# Altium schematic sheet Gagabiro_power_supply_maida.SchDoc
size 393 x 281 mm; SheetNumber: 3; SheetTotal: 4
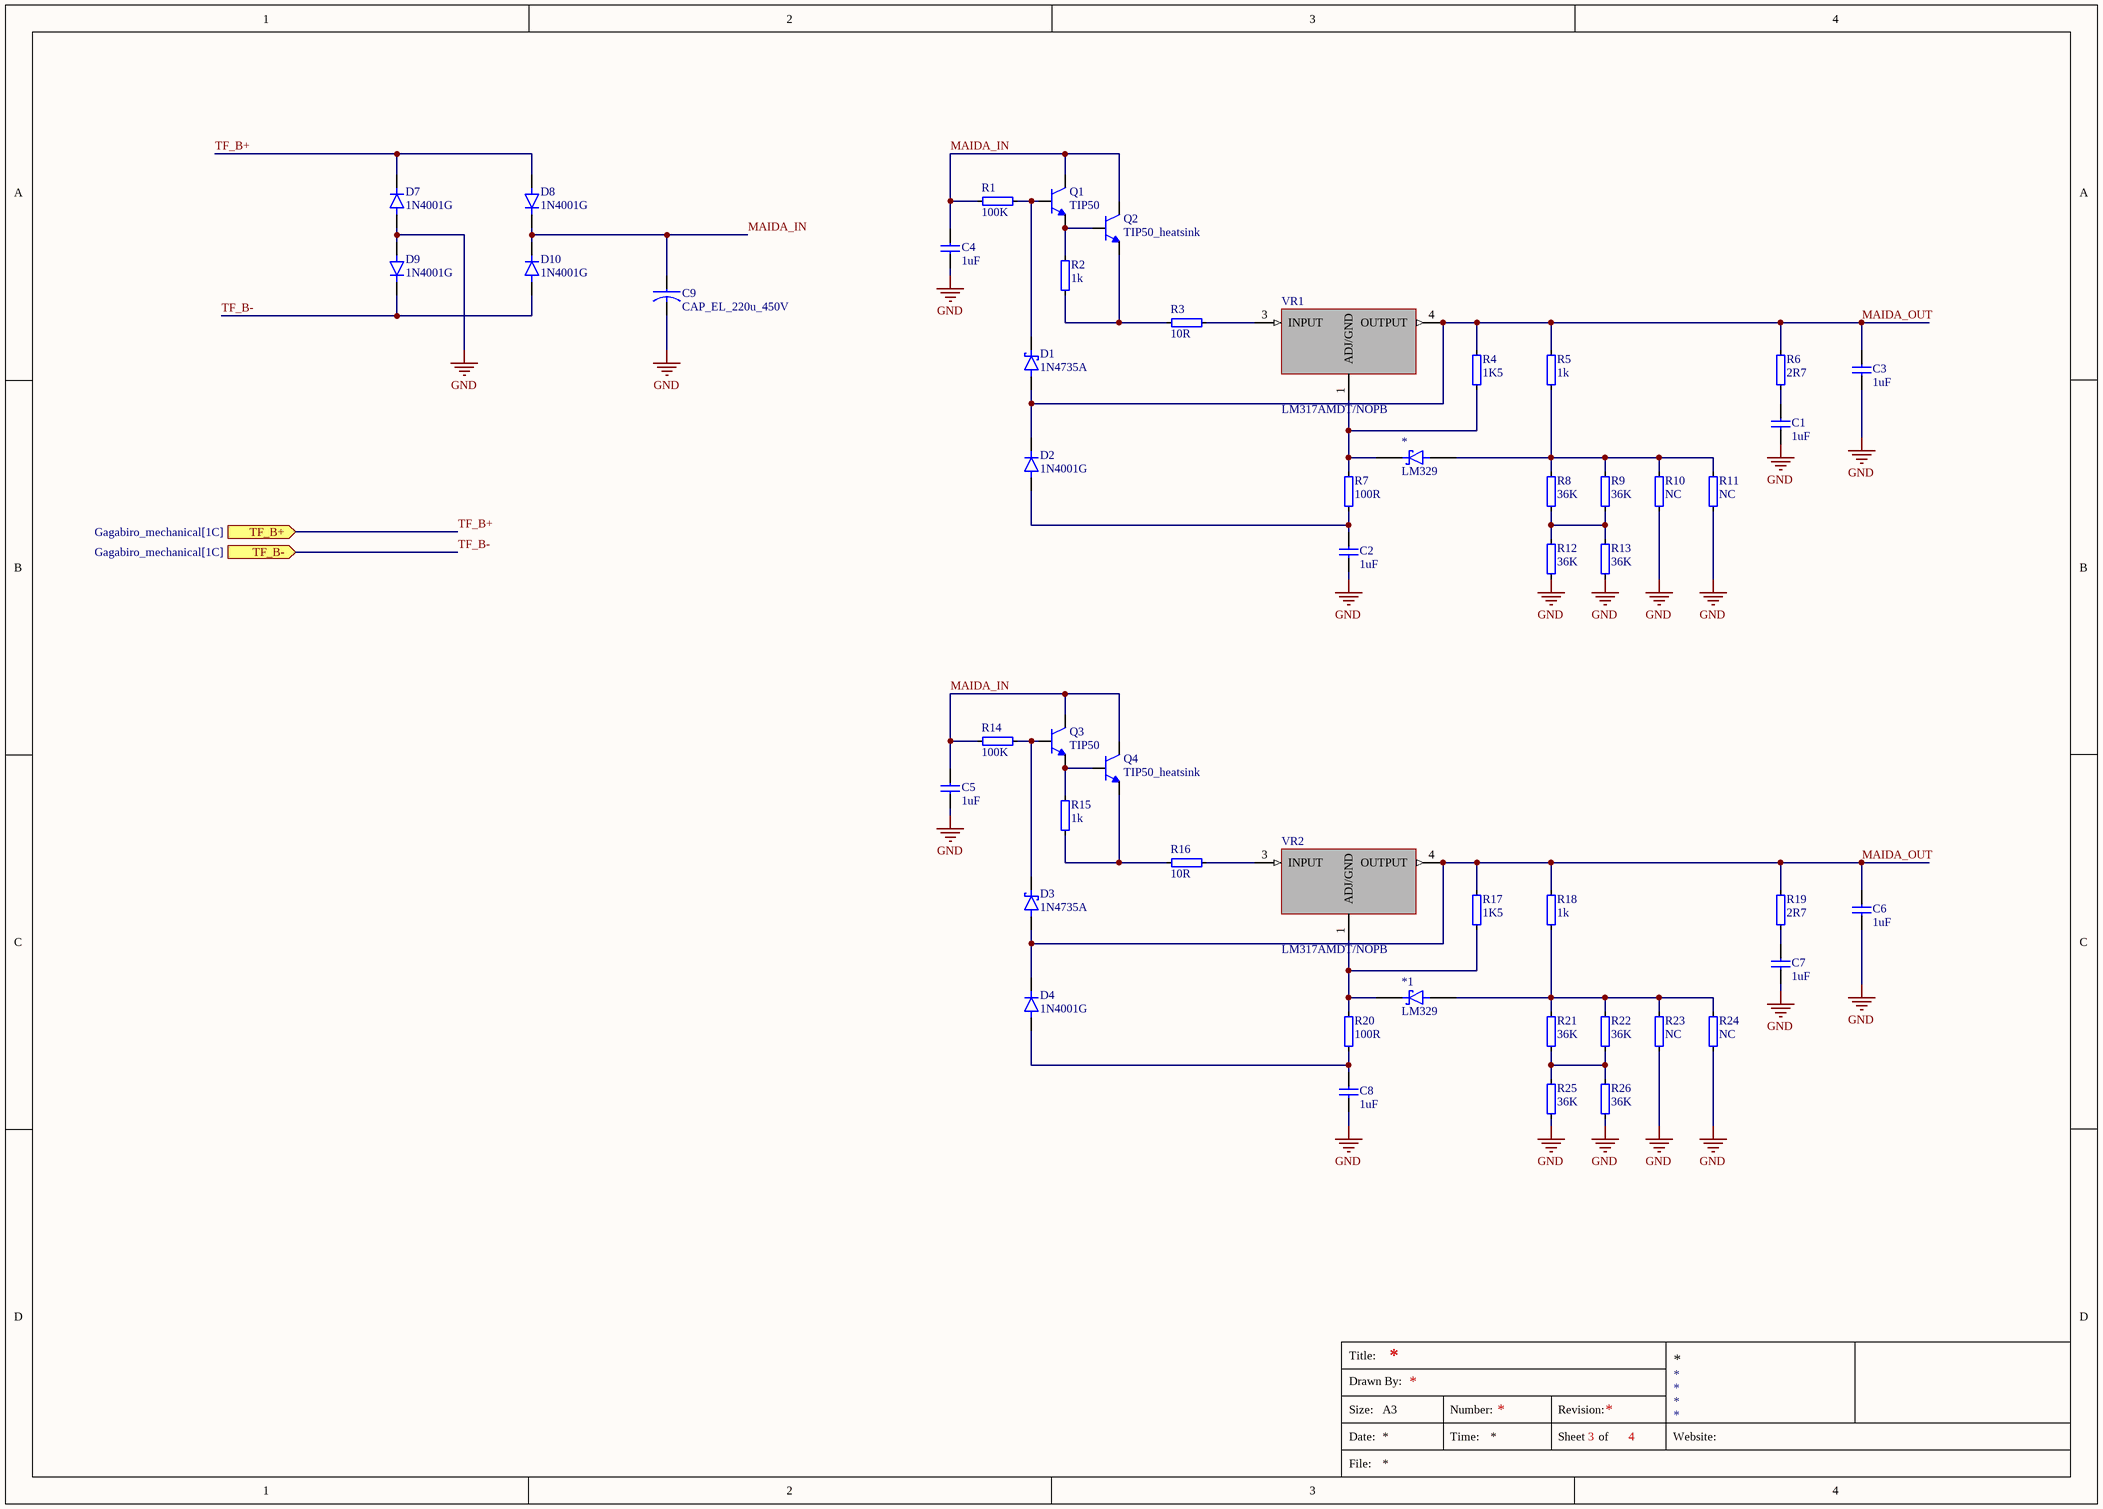
[diagram p0: Gagabiro_power_supply_maida.SchDoc]

## Parts
*  LM329  [TO92127P495H495-3]
*1  LM329  [TO92127P495H495-3]
C1  1uF  [CAP_panassonic_1u_450V]
C2  1uF  [CAP_panassonic_1u_450V]
C3  1uF  [CAP_panassonic_1u_450V]
C4  1uF  [CAP_panassonic_1u_450V]
C5  1uF  [CAP_panassonic_1u_450V]
C6  1uF  [CAP_panassonic_1u_450V]
C7  1uF  [CAP_panassonic_1u_450V]
C8  1uF  [CAP_panassonic_1u_450V]
C9  CAP_EL_220u_450V  [CAPPRD500W50D630H1120_stand_25x50]
D1  1N4735A  [DIOAD1036W78L463D272]
D2  1N4001G  [DIOAD1036W78L470D235]
D3  1N4735A  [DIOAD1036W78L463D272]
D4  1N4001G  [DIOAD1036W78L470D235]
D7  1N4001G  [DIOAD1036W78L470D235]
D8  1N4001G  [DIOAD1036W78L470D235]
D9  1N4001G  [DIOAD1036W78L470D235]
D10  1N4001G  [DIOAD1036W78L470D235]
Q1  TIP50  [TO254P1009X445X1985-3]
Q2  TIP50_heatsink  [TO254P1009X445X1985-3_heatsink]
Q3  TIP50  [TO254P1009X445X1985-3]
Q4  TIP50_heatsink  [TO254P1009X445X1985-3_heatsink]
R1  100K  [RES_2W_vertical]
R2  1k  [RES_2W_vertical]
R3  10R  [RES_2W_vertical]
R4  1K5  [RES_2W_vertical]
R5  1k  [RES_2W_vertical]
R6  2R7  [RES_2W_vertical]
R7  100R  [RES_2W_vertical]
R8  36K  [RES_2W_vertical]
R9  36K  [RES_2W_vertical]
R10  NC  [RES_2W_vertical]
R11  NC  [RES_2W_vertical]
R12  36K  [RES_2W_vertical]
R13  36K  [RES_2W_vertical]
R14  100K  [RES_2W_vertical]
R15  1k  [RES_2W_vertical]
R16  10R  [RES_2W_vertical]
R17  1K5  [RES_2W_vertical]
R18  1k  [RES_2W_vertical]
R19  2R7  [RES_2W_vertical]
R20  100R  [RES_2W_vertical]
R21  36K  [RES_2W_vertical]
R22  36K  [RES_2W_vertical]
R23  NC  [RES_2W_vertical]
R24  NC  [RES_2W_vertical]
R25  36K  [RES_2W_vertical]
R26  36K  [RES_2W_vertical]
VR1  LM317AMDT/NOPB  [TO228P991X255-3N]
VR2  LM317AMDT/NOPB  [TO228P991X255-3N]

## Ports
TF_B+ (in, see Gagabiro_mechanical[1C]), TF_B- (in, see Gagabiro_mechanical[1C])

## Nets
GND: C1.1 C2.1 C3.1 C4.1 C5.1 C6.1 C7.1 C8.1 C9.N D7.A D9.A R10.1 R11.1 R12.1 R13.1 R23.1 R24.1 R25.1 R26.1
MAIDA_IN: C4.2 C5.2 C9.P D8.C(K) D10.C(K) Q1.2(C) Q2.2(C) Q3.2(C) Q4.2(C) R1.1 R14.1
MAIDA_OUT: C3.2 C6.2 D1.2(A) D2.C(K) D3.2(A) D4.C(K) R4.2 R5.2 R6.2 R17.2 R18.2 R19.2 VR1.4(OUTPUT) VR2.4(OUTPUT)
TF_B+: D7.C(K) D8.A ; port TF_B+
TF_B-: D9.C(K) D10.A ; port TF_B-
Net*1_2: *1.2 R17.1 R20.2 VR2.1(ADJ/GND)
Net*1_3: *1.3 R18.1 R21.2 R22.2 R23.2 R24.2
Net*_2: *.2 R4.1 R7.2 VR1.1(ADJ/GND)
Net*_3: *.3 R5.1 R8.2 R9.2 R10.2 R11.2
NetC1_2: C1.2 R6.1
NetC2_2: C2.2 D2.A R7.1
NetC7_2: C7.2 R19.1
NetC8_2: C8.2 D4.A R20.1
NetD1_1: D1.1(K) Q1.1(B) R1.2
NetD3_1: D3.1(K) Q3.1(B) R14.2
NetQ1_3: Q1.3(E) Q2.1(B) R2.2
NetQ2_3: Q2.3(E) R2.1 R3.2
NetQ3_3: Q3.3(E) Q4.1(B) R15.2
NetQ4_3: Q4.3(E) R15.1 R16.2
NetR3_1: R3.1 VR1.3(INPUT)
NetR8_1: R8.1 R9.1 R12.2 R13.2
NetR16_1: R16.1 VR2.3(INPUT)
NetR21_1: R21.1 R22.1 R25.2 R26.2

## Notes on the sheet
- Title:
- Drawn By:
- Size:
- Date:
- File:
- A3
- Number:
- Time:
- Revision:
- Sheet
- of
- Website:

## Library data of the parts
C1-C8 = CAP_POLY_1u: Capacitor, Silver Mica; Part Number: CMICA_47PF; Value: 1uF
C9 = CAP_EL_220u_450V: 220F 16V Aluminum Electrolytic Capacitors Radial, Can 1000 Hrs @ 105C; MP: EEU-HD1C221B; Value: 220uF; MF: Panasonic; Availability: In Stock; Purchase-URL: https://pricing.snapeda.com/search/part/EEU-HD1C221B/?ref=eda; Package: RADIAL-2 Panasonic; Check_prices: https://www.snapeda.com/parts/EEU-HD1C221B/Panasonic/view-part/?ref=eda; SnapEDA_Link: https://www.snapeda.com/parts/EEU-HD1C221B/Panasonic/view-part/?ref=snap; Price: None
D1 D3 = 1N4735A: Zener Diode 6.2V 1W Â±5% Through Hole DO-204AL (DO-41); MF: ON Semiconductor; SnapEDA_Link: https://www.snapeda.com/parts/1N4735A/Onsemi/view-part/?ref=snap; Package: DO-41 ON Semiconductor; Value: *; MP: 1N4735A; Check_prices: https://www.snapeda.com/parts/1N4735A/Onsemi/view-part/?ref=eda
D2 D4 D7-D10 = 1N4001G: 1A, 50V, Standard Recovery Rectifier; MF: Taiwan Semiconductor; Package: DO-41-2 Taiwan Semiconductor; Check_prices: https://www.snapeda.com/parts/1N4001G/Taiwan+Semiconductor/view-part/?ref=eda; Value: *; Price: None; MP: 1N4001G; Purchase-URL: https://pricing.snapeda.com/search/part/1N4001G/?ref=eda; SnapEDA_Link: https://www.snapeda.com/parts/1N4001G/Taiwan+Semiconductor/view-part/?ref=snap; Availability: In Stock
Q1 Q3 = TIP50: Bipolar (BJT) Transistor NPN 400 V 1 A 10MHz 2 W Through Hole TO-220-3; MF: ON Semiconductor; Price: None; SnapEDA_Link: https://www.snapeda.com/parts/TIP50/Onsemi/view-part/?ref=snap; Availability: In Stock; Value: *; MP: TIP50; Purchase-URL: https://pricing.snapeda.com/search/part/TIP50/?ref=eda; Package: TO-220-3 onsemi; Check_prices: https://www.snapeda.com/parts/TIP50/Onsemi/view-part/?ref=eda
Q2 Q4 = TIP50_heatsink: Bipolar (BJT) Transistor NPN 400 V 1 A 10MHz 2 W Through Hole TO-220-3; MF: ON Semiconductor; MP: TIP50; Price: None; SnapEDA_Link: https://www.snapeda.com/parts/TIP50/Onsemi/view-part/?ref=snap; Availability: In Stock; Value: *; Purchase-URL: https://pricing.snapeda.com/search/part/TIP50/?ref=eda; Package: TO-220-3 onsemi; Check_prices: https://www.snapeda.com/parts/TIP50/Onsemi/view-part/?ref=eda
R1 R14 = R_2W_vertical_100K: Resistor, 2W; Part Number: R2W; ComponentLink1URL: N.A.; ComponentLink1Description: Datasheet; ComponentLink2URL: N.A.; ComponentLink2Description: Supplier link; Author: colombari; Value: 100K
R2 R5 R15 R18 = R_2W_vertical_1k: Resistor, 2W; Part Number: R2W; ComponentLink1URL: N.A.; ComponentLink1Description: Datasheet; ComponentLink2URL: N.A.; ComponentLink2Description: Supplier link; Author: colombari; Value: 1k
R3 R16 = R_2W_vertical_10R: Resistor, 2W; Part Number: R2W; ComponentLink1URL: N.A.; ComponentLink1Description: Datasheet; ComponentLink2URL: N.A.; ComponentLink2Description: Supplier link; Author: colombari; Value: 10R
R4 R17 = R_2W_vertical_1K5: Resistor, 2W; Part Number: R2W; ComponentLink1URL: N.A.; ComponentLink1Description: Datasheet; ComponentLink2URL: N.A.; ComponentLink2Description: Supplier link; Author: colombari; Value: 1K5
R6 R19 = R_2W_vertical_2R7: Resistor, 2W; Part Number: R2W; ComponentLink1URL: N.A.; ComponentLink1Description: Datasheet; ComponentLink2URL: N.A.; ComponentLink2Description: Supplier link; Author: colombari; Value: 2R7
R7 R20 = R_2W_vertical_100R: Resistor, 2W; Part Number: R2W; ComponentLink1URL: N.A.; ComponentLink1Description: Datasheet; ComponentLink2URL: N.A.; ComponentLink2Description: Supplier link; Author: colombari; Value: 100R
R8 R9 R12 R13 R21 R22 R25 R26 = R_2W_vertical_36K: Resistor, 2W; Part Number: R2W; ComponentLink1URL: N.A.; ComponentLink1Description: Datasheet; ComponentLink2URL: N.A.; ComponentLink2Description: Supplier link; Author: colombari; Value: 36K
R10 R11 R23 R24 = R_2W_vertical_NC: Resistor, 2W; Part Number: R2W; ComponentLink1URL: N.A.; ComponentLink1Description: Datasheet; ComponentLink2URL: N.A.; ComponentLink2Description: Supplier link; Author: colombari; Value: NC
VR1 VR2 = LM317AMDT/NOPB: Package: None; MP: LM317AMDT/NOPB; Price: None; Availability: Unavailable; Value: *